# Altium project macropad-pcb.PrjPcb
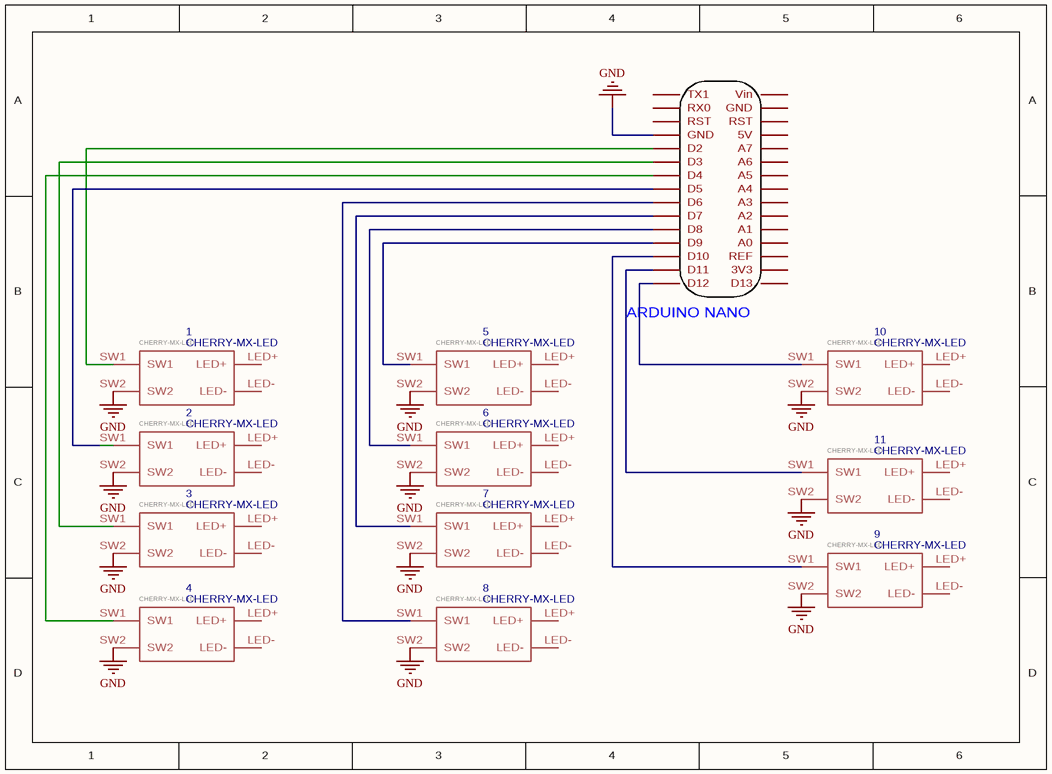
[diagram p0: macropad.schdoc]
1 sheet, 12 parts. Net scope: global (net labels, ports and power ports of the same name join across sheets).
Board file: board.pcbdoc

## Sheet macropad.schdoc
size 196 x 143 mm; SheetNumber: 1; SheetTotal: 1

### Parts
1  CHERRY-MX-LED  [CHERRY-MX-LED]
2  CHERRY-MX-LED  [CHERRY-MX-LED]
3  CHERRY-MX-LED  [CHERRY-MX-LED]
4  CHERRY-MX-LED  [CHERRY-MX-LED]
5  CHERRY-MX-LED  [CHERRY-MX-LED]
6  CHERRY-MX-LED  [CHERRY-MX-LED]
7  CHERRY-MX-LED  [CHERRY-MX-LED]
8  CHERRY-MX-LED  [CHERRY-MX-LED]
9  CHERRY-MX-LED  [CHERRY-MX-LED]
10  CHERRY-MX-LED  [CHERRY-MX-LED]
11  CHERRY-MX-LED  [CHERRY-MX-LED]
M1  Arduino Nano  [ARDUINO NANO]  (value not drawn)

### Nets
GND: 1.SW2 2.SW2 3.SW2 4.SW2 5.SW2 6.SW2 7.SW2 8.SW2 9.SW2 10.SW2 11.SW2 M1.27(GND)
Net1_SW1: 1.SW1 M1.26(D2)
Net2_SW1: 2.SW1 M1.23(D5)
Net3_SW1: 3.SW1 M1.25(D3)
Net4_SW1: 4.SW1 M1.24(D4)
Net5_SW1: 5.SW1 M1.19(D9)
Net6_SW1: 6.SW1 M1.20(D8)
Net7_SW1: 7.SW1 M1.21(D7)
Net8_SW1: 8.SW1 M1.22(D6)
Net9_SW1: 9.SW1 M1.18(D10)
Net10_SW1: 10.SW1 M1.16(D12)
Net11_SW1: 11.SW1 M1.17(D11)

Not connected (* = marked no-connect by the designer): 1 LED+ LED-; 2 LED+ LED-; 3 LED+ LED-; 4 LED+ LED-; 5 LED+ LED-; 6 LED+ LED-; 7 LED+ LED-; 8 LED+ LED-; 9 LED+ LED-; 10 LED+ LED-; 11 LED+ LED-; M1 1(Vin) 2(GND) 3(RST) 4(5V) 5(A7) 6(A6) 7(A5) 8(A4) 9(A3) 10(A2) 11(A1) 12(A0) 13(REF) 14(3V3) 15(D13) 28(RST) 29(RX0) 30(TX1)

### Notes on the sheet
- (in symbol Arduino Nano) ARDUINO NANO

### Library data of the parts
1-11 = CHERRY-MX-LED: Contributor: spaceman35; spicePre: ?; spiceSymbolName: CHERRY-MX-LED
M1 = Arduino Nano: Contributor: hctan22; Manufacturer Part: Arduino Nano; spicePre: M; spiceSymbolName: Arduino Nano